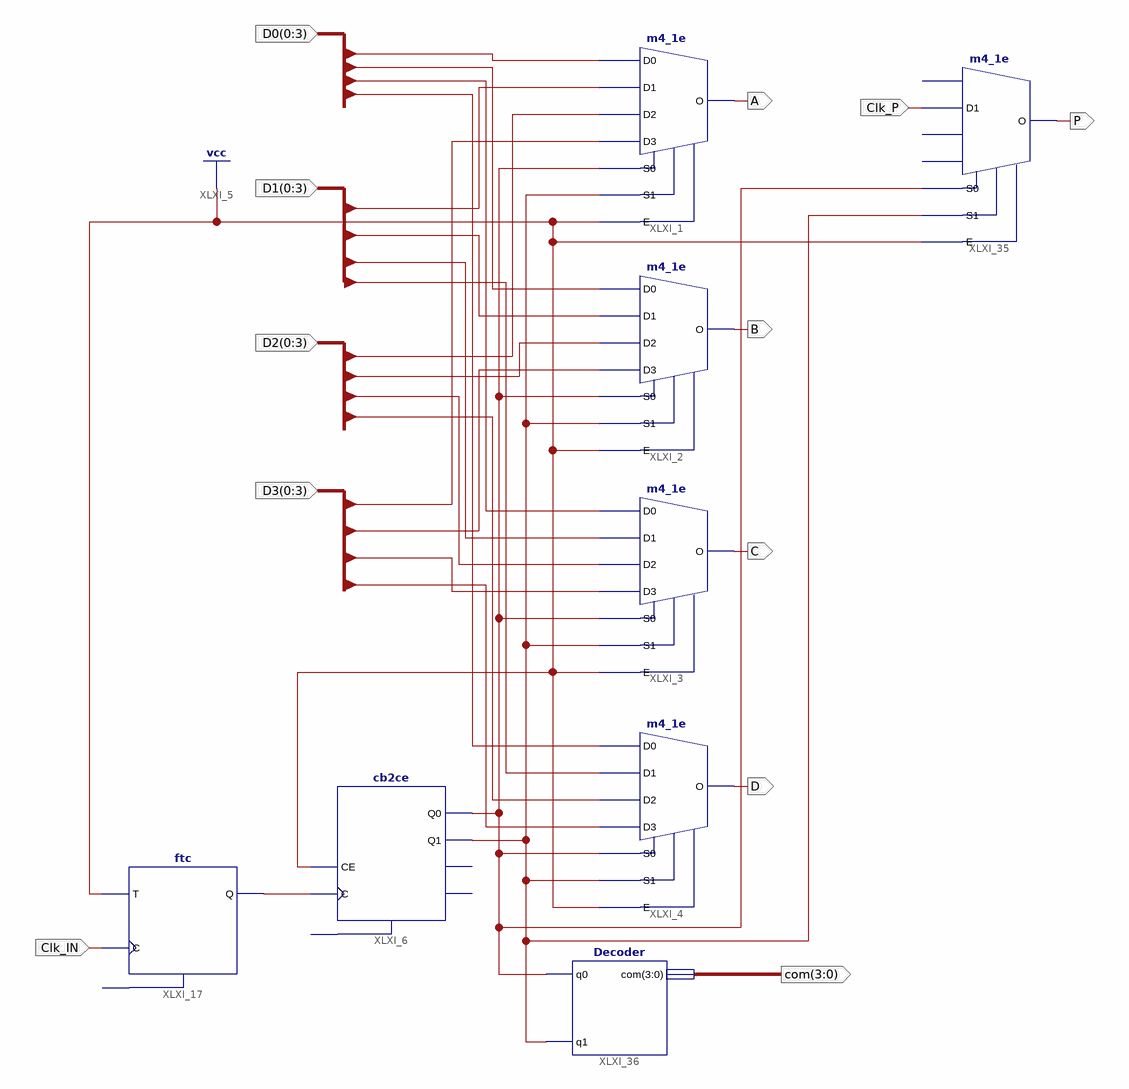
[diagram p0: schematic sheet 1]
// Xilinx ISE schematic MUX.sch (spartan6) as structural Verilog: 8 symbols, 12 ports
module MUX (
  input  [0:3] D0,
  input  [0:3] D1,
  input  [0:3] D2,
  input  [0:3] D3,
  input  Clk_IN,
  input  Clk_P,
  output [3:0] com,
  output A,
  output B,
  output C,
  output D,
  output P
);

  wire XLXN_35, XLXN_36, XLXN_37, XLXN_43, XLXN_44, XLXN_45, XLXN_46, XLXN_49, XLXN_50, XLXN_51, XLXN_52,
       XLXN_53, XLXN_57, XLXN_58, XLXN_59, XLXN_60, XLXN_127, XLXN_128, XLXN_129;

  m4_1e XLXI_1 (.D0(XLXN_129), .D1(XLXN_43), .D2(XLXN_49), .D3(XLXN_57), .E(1'b1), .S0(XLXN_127), .S1(XLXN_128), .O(A));
  m4_1e XLXI_2 (.D0(XLXN_35), .D1(XLXN_44), .D2(XLXN_50), .D3(XLXN_58), .E(1'b1), .S0(XLXN_127), .S1(XLXN_128), .O(B));
  m4_1e XLXI_3 (.D0(XLXN_36), .D1(XLXN_45), .D2(XLXN_51), .D3(XLXN_59), .E(1'b1), .S0(XLXN_127), .S1(XLXN_128), .O(C));
  m4_1e XLXI_4 (.D0(XLXN_37), .D1(XLXN_46), .D2(XLXN_52), .D3(XLXN_60), .E(1'b1), .S0(XLXN_127), .S1(XLXN_128), .O(D));
  cb2ce XLXI_6 (.C(XLXN_53), .CE(1'b1), .Q0(XLXN_127), .Q1(XLXN_128));  // open: CLR, CEO, TC
  ftc XLXI_17 (.C(Clk_IN), .T(1'b1), .Q(XLXN_53));  // open: CLR
  m4_1e XLXI_35 (.D1(Clk_P), .E(1'b1), .S0(XLXN_127), .S1(XLXN_128), .O(P));  // open: D0, D2, D3
  Decoder XLXI_36 (.com(com), .q0(XLXN_127), .q1(XLXN_128));
endmodule
